# Altium schematic sheet 框图.SchDoc
size A3
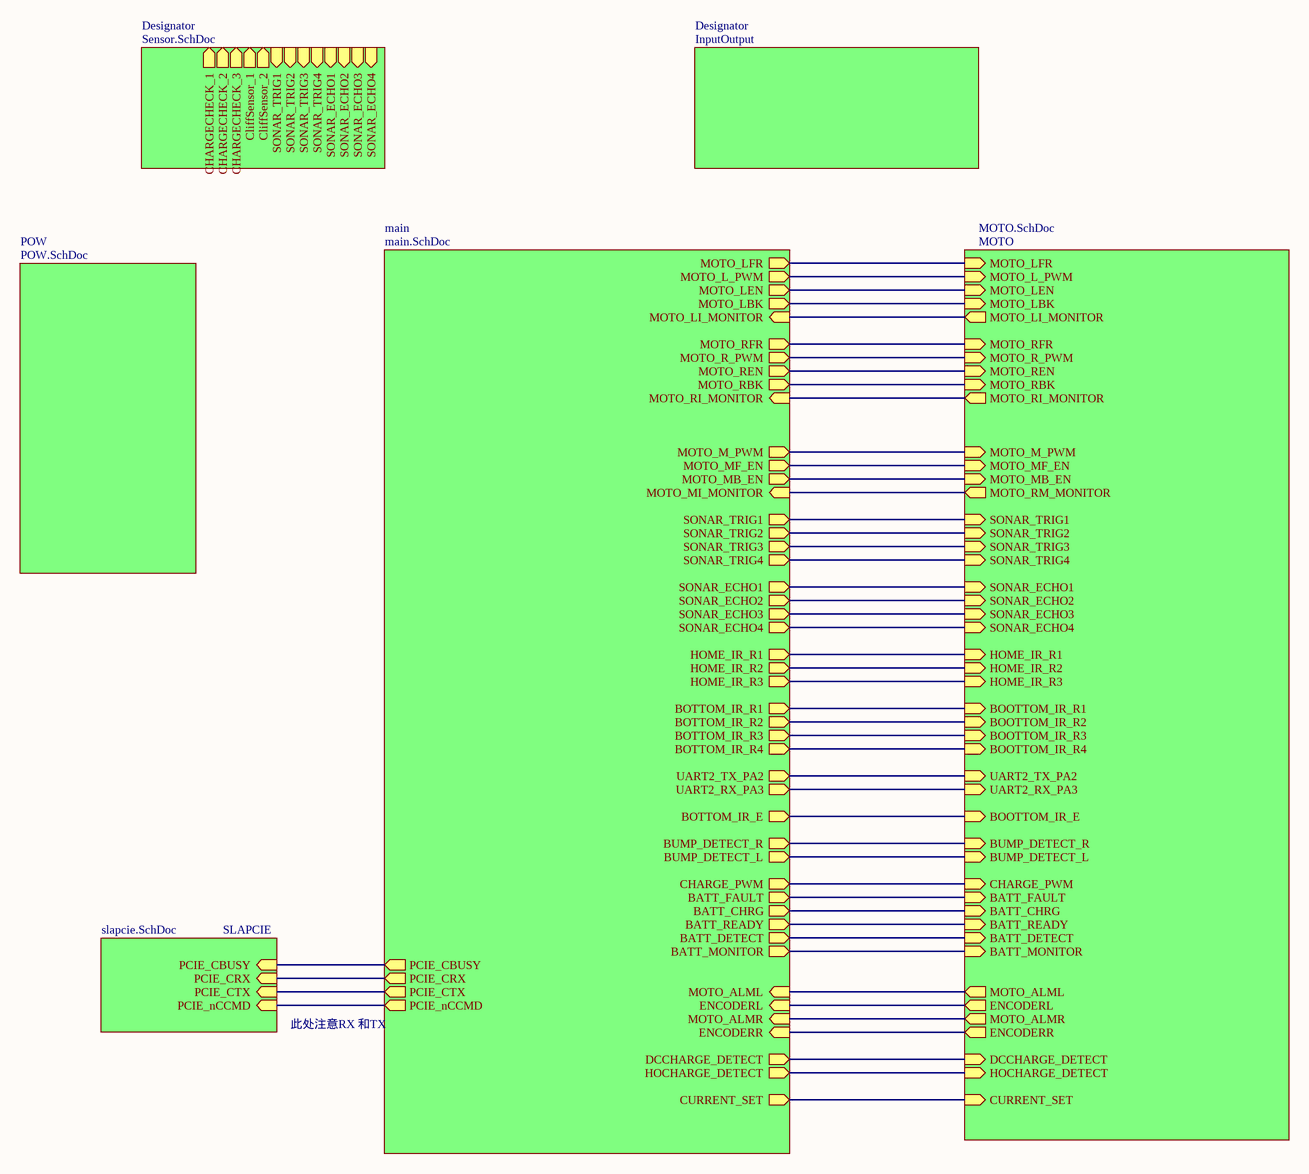
[diagram p0: 框图.SchDoc]

## Sub-sheets
Designator = Sensor.SchDoc: CHARGECHECK_1 (out), CHARGECHECK_2 (out), CHARGECHECK_3 (out), CliffSensor_1 (out), CliffSensor_2 (out), SONAR_TRIG1 (in), SONAR_TRIG2 (in), SONAR_TRIG3 (in), SONAR_TRIG4 (in), SONAR_ECHO1 (in), SONAR_ECHO2 (in), SONAR_ECHO3 (in), SONAR_ECHO4 (in)
Designator = InputOutput: no entries
main = main.SchDoc: CHARGE_PWM (out), UART2_TX_PA2 (out), UART2_RX_PA3 (out), BOTTOM_IR_R4 (out), BATT_DETECT (out), PCIE_CBUSY (out), BUMP_DETECT_L (out), HOCHARGE_DETECT (out), DCCHARGE_DETECT (out), BUMP_DETECT_R (out), CURRENT_SET (out), BOTTOM_IR_R2 (out), BOTTOM_IR_R1 (out), BATT_MONITOR (out), BOTTOM_IR_R3 (out), MOTO_RI_MONITOR (in), BOTTOM_IR_E (out), PCIE_nCCMD (out), MOTO_MB_EN (out), MOTO_M_PWM (out), MOTO_MF_EN (out), MOTO_LEN (out), MOTO_REN (out), MOTO_RBK (out), MOTO_LBK (out), HOME_IR_R1 (out), HOME_IR_R2 (out), HOME_IR_R3 (out), BATT_READY (out), BATT_CHRG (out), BATT_FAULT (out), SONAR_ECHO1 (out), SONAR_ECHO2 (out), SONAR_ECHO3 (out), SONAR_ECHO4 (out), SONAR_TRIG1 (out), SONAR_TRIG2 (out), SONAR_TRIG3 (out), MOTO_R_PWM (out), MOTO_L_PWM (out), SONAR_TRIG4 (out), PCIE_CRX (out), PCIE_CTX (out), MOTO_MI_MONITOR (in), MOTO_LI_MONITOR (in), MOTO_ALML (in), ENCODERL (in), MOTO_ALMR (in), ENCODERR (in), MOTO_LFR (out), MOTO_RFR (out)
MOTO = MOTO.SchDoc: MOTO_L_PWM (in), MOTO_LEN (in), MOTO_LBK (in), MOTO_R_PWM (in), MOTO_REN (in), MOTO_RBK (in), MOTO_MF_EN (in), MOTO_MB_EN (in), MOTO_LI_MONITOR (out), MOTO_RI_MONITOR (out), MOTO_RM_MONITOR (out), MOTO_ALML (out), ENCODERL (out), MOTO_ALMR (out), ENCODERR (out), SONAR_TRIG1 (in), SONAR_TRIG2 (in), SONAR_TRIG3 (in), SONAR_TRIG4 (in), SONAR_ECHO1 (in), SONAR_ECHO2 (in), SONAR_ECHO3 (in), SONAR_ECHO4 (in), HOME_IR_R1 (in), HOME_IR_R2 (in), HOME_IR_R3 (in), BOOTTOM_IR_R1 (in), BOOTTOM_IR_R2 (in), BOOTTOM_IR_R3 (in), BOOTTOM_IR_R4 (in), BOOTTOM_IR_E (in), BUMP_DETECT_R (in), BUMP_DETECT_L (in), UART2_TX_PA2 (in), UART2_RX_PA3 (in), CHARGE_PWM (in), BATT_FAULT (in), BATT_CHRG (in), BATT_READY (in), BATT_DETECT (in), DCCHARGE_DETECT (in), HOCHARGE_DETECT (in), BATT_MONITOR (in), CURRENT_SET (in), MOTO_M_PWM (in), MOTO_LFR (in), MOTO_RFR (in)
POW = POW.SchDoc: no entries
SLAPCIE = slapcie.SchDoc: PCIE_CBUSY (in), PCIE_CRX (in), PCIE_CTX (in), PCIE_nCCMD (in)

## Nets
(unnamed): sheet main/CHARGE_PWM, sheet MOTO/CHARGE_PWM
(unnamed): sheet main/UART2_TX_PA2, sheet MOTO/UART2_TX_PA2
(unnamed): sheet main/UART2_RX_PA3, sheet MOTO/UART2_RX_PA3
(unnamed): sheet main/BOTTOM_IR_R4, sheet MOTO/BOOTTOM_IR_R4
(unnamed): sheet main/BATT_DETECT, sheet MOTO/BATT_DETECT
(unnamed): sheet main/PCIE_CBUSY, sheet SLAPCIE/PCIE_CBUSY
(unnamed): sheet main/BUMP_DETECT_L, sheet MOTO/BUMP_DETECT_L
(unnamed): sheet main/HOCHARGE_DETECT, sheet MOTO/HOCHARGE_DETECT
(unnamed): sheet main/DCCHARGE_DETECT, sheet MOTO/DCCHARGE_DETECT
(unnamed): sheet main/BUMP_DETECT_R, sheet MOTO/BUMP_DETECT_R
(unnamed): sheet main/CURRENT_SET, sheet MOTO/CURRENT_SET
(unnamed): sheet main/BOTTOM_IR_R2, sheet MOTO/BOOTTOM_IR_R2
(unnamed): sheet main/BOTTOM_IR_R1, sheet MOTO/BOOTTOM_IR_R1
(unnamed): sheet main/BATT_MONITOR, sheet MOTO/BATT_MONITOR
(unnamed): sheet main/BOTTOM_IR_R3, sheet MOTO/BOOTTOM_IR_R3
(unnamed): sheet main/MOTO_RI_MONITOR, sheet MOTO/MOTO_RI_MONITOR
(unnamed): sheet main/BOTTOM_IR_E, sheet MOTO/BOOTTOM_IR_E
(unnamed): sheet main/PCIE_nCCMD, sheet SLAPCIE/PCIE_nCCMD
(unnamed): sheet main/MOTO_MB_EN, sheet MOTO/MOTO_MB_EN
(unnamed): sheet main/MOTO_M_PWM, sheet MOTO/MOTO_M_PWM
(unnamed): sheet main/MOTO_MF_EN, sheet MOTO/MOTO_MF_EN
(unnamed): sheet main/MOTO_LEN, sheet MOTO/MOTO_LEN
(unnamed): sheet main/MOTO_REN, sheet MOTO/MOTO_REN
(unnamed): sheet main/MOTO_RBK, sheet MOTO/MOTO_RBK
(unnamed): sheet main/MOTO_LBK, sheet MOTO/MOTO_LBK
(unnamed): sheet main/HOME_IR_R1, sheet MOTO/HOME_IR_R1
(unnamed): sheet main/HOME_IR_R2, sheet MOTO/HOME_IR_R2
(unnamed): sheet main/HOME_IR_R3, sheet MOTO/HOME_IR_R3
(unnamed): sheet main/BATT_READY, sheet MOTO/BATT_READY
(unnamed): sheet main/BATT_CHRG, sheet MOTO/BATT_CHRG
(unnamed): sheet main/BATT_FAULT, sheet MOTO/BATT_FAULT
(unnamed): sheet main/SONAR_ECHO1, sheet MOTO/SONAR_ECHO1
(unnamed): sheet main/SONAR_ECHO2, sheet MOTO/SONAR_ECHO2
(unnamed): sheet main/SONAR_ECHO3, sheet MOTO/SONAR_ECHO3
(unnamed): sheet main/SONAR_ECHO4, sheet MOTO/SONAR_ECHO4
(unnamed): sheet main/SONAR_TRIG1, sheet MOTO/SONAR_TRIG1
(unnamed): sheet main/SONAR_TRIG2, sheet MOTO/SONAR_TRIG2
(unnamed): sheet main/SONAR_TRIG3, sheet MOTO/SONAR_TRIG3
(unnamed): sheet main/MOTO_R_PWM, sheet MOTO/MOTO_R_PWM
(unnamed): sheet main/MOTO_L_PWM, sheet MOTO/MOTO_L_PWM
(unnamed): sheet main/SONAR_TRIG4, sheet MOTO/SONAR_TRIG4
(unnamed): sheet main/PCIE_CRX, sheet SLAPCIE/PCIE_CRX
(unnamed): sheet main/PCIE_CTX, sheet SLAPCIE/PCIE_CTX
(unnamed): sheet main/MOTO_MI_MONITOR, sheet MOTO/MOTO_RM_MONITOR
(unnamed): sheet main/MOTO_LI_MONITOR, sheet MOTO/MOTO_LI_MONITOR
(unnamed): sheet main/MOTO_ALML, sheet MOTO/MOTO_ALML
(unnamed): sheet main/ENCODERL, sheet MOTO/ENCODERL
(unnamed): sheet main/MOTO_ALMR, sheet MOTO/MOTO_ALMR
(unnamed): sheet main/ENCODERR, sheet MOTO/ENCODERR
(unnamed): sheet main/MOTO_LFR, sheet MOTO/MOTO_LFR
(unnamed): sheet main/MOTO_RFR, sheet MOTO/MOTO_RFR

## Notes on the sheet
- 此处注意RX 和TX